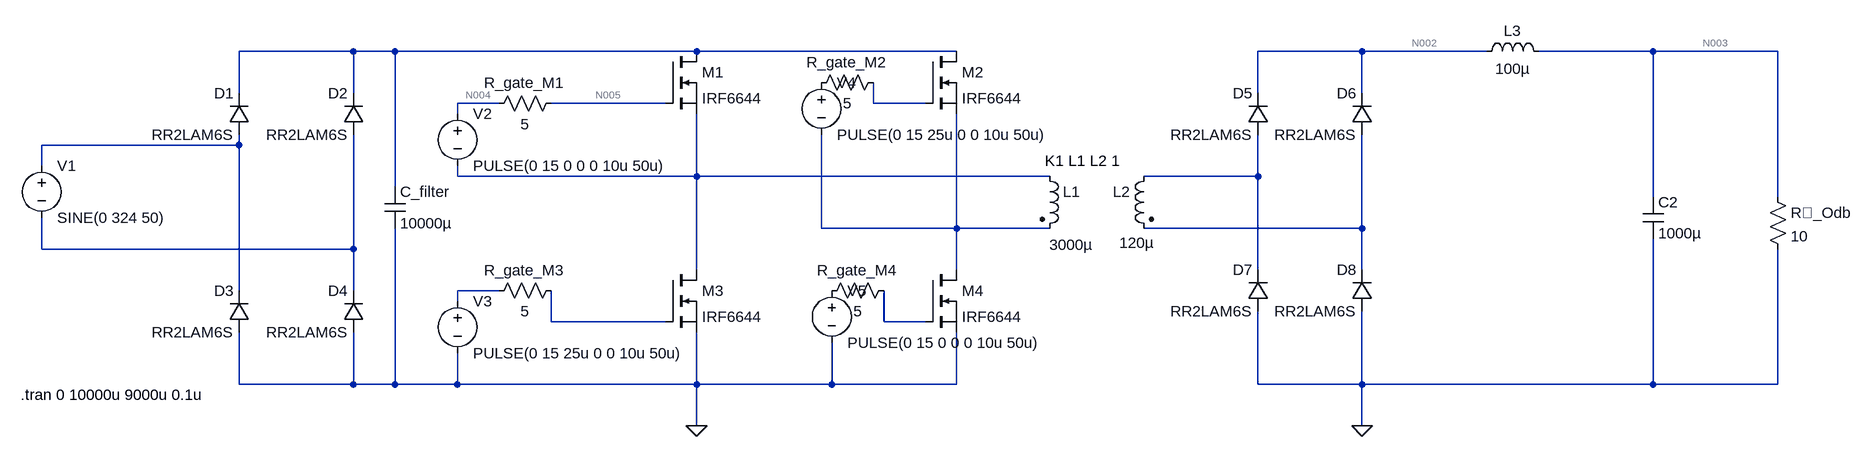
[diagram p0: schematic Draft1.asc]
Draft1.asc, the LTspice schematic file:
Version 4
SHEET 1 2252 680
WIRE -64 -80 -240 -80
WIRE 0 -80 -64 -80
WIRE 464 -80 0 -80
WIRE 864 -80 464 -80
WIRE 1488 -80 1328 -80
WIRE 1680 -80 1488 -80
WIRE 1936 -80 1760 -80
WIRE 2128 -80 1936 -80
WIRE -240 -16 -240 -80
WIRE -64 -16 -64 -80
WIRE 1328 -16 1328 -80
WIRE 1488 -16 1488 -80
WIRE 160 0 96 0
WIRE 416 0 240 0
WIRE 736 0 736 -32
WIRE 816 0 736 0
WIRE 96 16 96 0
WIRE -240 64 -240 48
WIRE -240 64 -544 64
WIRE -544 96 -544 64
WIRE 96 112 96 96
WIRE 464 112 464 16
WIRE 464 112 96 112
WIRE 1008 112 464 112
WIRE 1328 112 1328 48
WIRE 1328 112 1152 112
WIRE 0 128 0 -80
WIRE 1936 144 1936 -80
WIRE 2128 144 2128 -80
WIRE 656 192 656 48
WIRE 864 192 864 16
WIRE 864 192 656 192
WIRE 1008 192 864 192
WIRE 1488 192 1488 48
WIRE 1488 192 1152 192
WIRE -544 224 -544 176
WIRE -64 224 -64 48
WIRE -64 224 -544 224
WIRE 464 256 464 112
WIRE 864 256 864 192
WIRE 1328 256 1328 112
WIRE 1488 256 1488 192
WIRE -240 288 -240 64
WIRE -64 288 -64 224
WIRE 160 288 96 288
WIRE 96 304 96 288
WIRE 240 336 240 288
WIRE 416 336 240 336
WIRE 752 336 752 288
WIRE 816 336 752 336
WIRE -240 432 -240 352
WIRE -64 432 -64 352
WIRE -64 432 -240 432
WIRE 0 432 0 192
WIRE 0 432 -64 432
WIRE 96 432 96 384
WIRE 96 432 0 432
WIRE 464 432 464 352
WIRE 464 432 96 432
WIRE 672 432 672 368
WIRE 672 432 464 432
WIRE 864 432 864 352
WIRE 864 432 672 432
WIRE 1328 432 1328 320
WIRE 1488 432 1488 320
WIRE 1488 432 1328 432
WIRE 1936 432 1936 208
WIRE 1936 432 1488 432
WIRE 2128 432 2128 224
WIRE 2128 432 1936 432
WIRE 464 496 464 432
WIRE 1488 496 1488 432
FLAG 464 496 0
FLAG 1488 496 0
SYMBOL voltage -544 80 R0
WINDOW 123 0 0 Left 0
WINDOW 39 0 0 Left 0
SYMATTR InstName V1
SYMATTR Value SINE(0 324 50)
SYMBOL diode -224 48 R180
WINDOW 0 24 64 Left 2
WINDOW 3 24 0 Left 2
SYMATTR InstName D1
SYMATTR Value RR2LAM6S
SYMBOL diode -48 48 R180
WINDOW 0 24 64 Left 2
WINDOW 3 24 0 Left 2
SYMATTR InstName D2
SYMATTR Value RR2LAM6S
SYMBOL diode -224 352 R180
WINDOW 0 24 64 Left 2
WINDOW 3 24 0 Left 2
SYMATTR InstName D3
SYMATTR Value RR2LAM6S
SYMBOL diode -48 352 R180
WINDOW 0 24 64 Left 2
WINDOW 3 24 0 Left 2
SYMATTR InstName D4
SYMATTR Value RR2LAM6S
SYMBOL cap -16 128 R0
SYMATTR InstName C_filter
SYMATTR Value 10000µ
SYMBOL ind2 992 96 R0
WINDOW 3 15 121 Left 2
SYMATTR Value 3000µ
SYMATTR InstName L1
SYMATTR Type ind
SYMBOL ind2 1168 96 M0
WINDOW 3 -1 118 Left 2
SYMATTR Value 120µ
SYMATTR InstName L2
SYMATTR Type ind
SYMBOL diode 1344 48 R180
WINDOW 0 24 64 Left 2
WINDOW 3 24 0 Left 2
SYMATTR InstName D5
SYMATTR Value RR2LAM6S
SYMBOL diode 1504 48 R180
WINDOW 0 24 64 Left 2
WINDOW 3 24 0 Left 2
SYMATTR InstName D6
SYMATTR Value RR2LAM6S
SYMBOL diode 1344 320 R180
WINDOW 0 24 64 Left 2
WINDOW 3 24 0 Left 2
SYMATTR InstName D7
SYMATTR Value RR2LAM6S
SYMBOL diode 1504 320 R180
WINDOW 0 24 64 Left 2
WINDOW 3 24 0 Left 2
SYMATTR InstName D8
SYMATTR Value RR2LAM6S
SYMBOL nmos 416 -80 R0
SYMATTR InstName M1
SYMATTR Value IRF6644
SYMBOL nmos 816 -80 R0
SYMATTR InstName M2
SYMATTR Value IRF6644
SYMBOL nmos 416 256 R0
SYMATTR InstName M3
SYMATTR Value IRF6644
SYMBOL ind 1664 -64 R270
WINDOW 0 32 56 VTop 2
WINDOW 3 5 56 VBottom 2
SYMATTR InstName L3
SYMATTR Value 100µ
SYMBOL cap 1920 144 R0
SYMATTR InstName C2
SYMATTR Value 1000µ
SYMBOL res 2112 128 R0
SYMATTR InstName R_Odb
SYMATTR Value 10
SYMBOL res 256 -16 R90
WINDOW 0 0 56 VBottom 2
WINDOW 3 32 56 VTop 2
SYMATTR InstName R_gate_M1
SYMATTR Value 5
SYMBOL voltage 96 0 R0
WINDOW 123 0 0 Left 0
WINDOW 39 0 0 Left 0
SYMATTR InstName V2
SYMATTR Value PULSE(0 15 0 0 0 10u 50u)
SYMBOL res 256 272 R90
WINDOW 0 0 56 VBottom 2
WINDOW 3 32 56 VTop 2
SYMATTR InstName R_gate_M3
SYMATTR Value 5
SYMBOL voltage 96 288 R0
WINDOW 123 0 0 Left 0
WINDOW 39 0 0 Left 0
SYMATTR InstName V3
SYMATTR Value PULSE(0 15 25u 0 0 10u 50u)
SYMBOL voltage 656 -48 R0
WINDOW 123 0 0 Left 0
WINDOW 39 0 0 Left 0
SYMATTR InstName V4
SYMATTR Value PULSE(0 15 25u 0 0 10u 50u)
SYMBOL res 752 -48 R90
WINDOW 0 0 56 VBottom 2
WINDOW 3 32 56 VTop 2
SYMATTR InstName R_gate_M2
SYMATTR Value 5
SYMBOL voltage 672 272 R0
WINDOW 123 0 0 Left 0
WINDOW 39 0 0 Left 0
SYMATTR InstName V5
SYMATTR Value PULSE(0 15 0 0 0 10u 50u)
SYMBOL res 768 272 R90
WINDOW 0 0 56 VBottom 2
WINDOW 3 32 56 VTop 2
SYMATTR InstName R_gate_M4
SYMATTR Value 5
SYMBOL nmos 816 256 R0
SYMATTR InstName M4
SYMATTR Value IRF6644
TEXT 1000 88 Left 2 !K1 L1 L2 1
TEXT -576 448 Left 2 !.tran 0 10000u 9000u 0.1u

The netlist it stands for:
* Draft1.asc
V1 N007 N012 SINE(0 324 50)
D1 N007 N001 RR2LAM6S
D2 N012 N001 RR2LAM6S
D3 0 N007 RR2LAM6S
D4 0 N012 RR2LAM6S
C_filter N001 0 10000µ
L1 N008 N010 3000µ
L2 N009 N011 120µ
D5 N009 N002 RR2LAM6S
D6 N011 N002 RR2LAM6S
D7 0 N009 RR2LAM6S
D8 0 N011 RR2LAM6S
M1 N001 N005 N008 N008 IRF6644
M2 N001 N006 N010 N010 IRF6644
M3 N008 N014 0 0 IRF6644
L3 N002 N003 100µ
C2 N003 0 1000µ
R_Odb N003 0 10
R_gate_M1 N005 N004 5
V2 N004 N008 PULSE(0 15 0 0 0 10u 50u)
R_gate_M3 N014 N013 5
V3 N013 0 PULSE(0 15 25u 0 0 10u 50u)
V4 P001 N010 PULSE(0 15 25u 0 0 10u 50u)
R_gate_M2 N006 P001 5
V5 P002 0 PULSE(0 15 0 0 0 10u 50u)
R_gate_M4 N015 P002 5
M4 N010 N015 0 0 IRF6644
.model D D
.lib standard.dio
.model NMOS NMOS
.model PMOS PMOS
.lib standard.mos
K1 L1 L2 1
.tran 0 10000u 9000u 0.1u
.backanno
.end

* Results of the author's LTspice run, read from the files saved beside the schematic
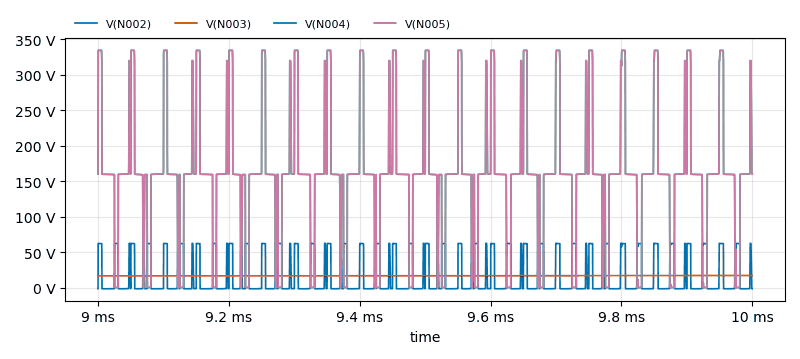
[diagram p1: Transient Analysis of Draft1.asc, plotted from the saved traces]
* Transient Analysis, 1 run:
*   V(N002): min -1.803 V, max 62.36 V, average 16.62 V, rms 32.81 V, last -1.624 V
*   V(N003): min 16.36 V, max 16.87 V, average 16.6 V, rms 16.6 V, last 16.87 V
*   V(N004): min -570.1 mV, max 334.3 V, average 161.4 V, rms 183.6 V, last 160.1 V
*   V(N005): min -562.2 mV, max 334.3 V, average 161.4 V, rms 183.6 V, last 160.1 V